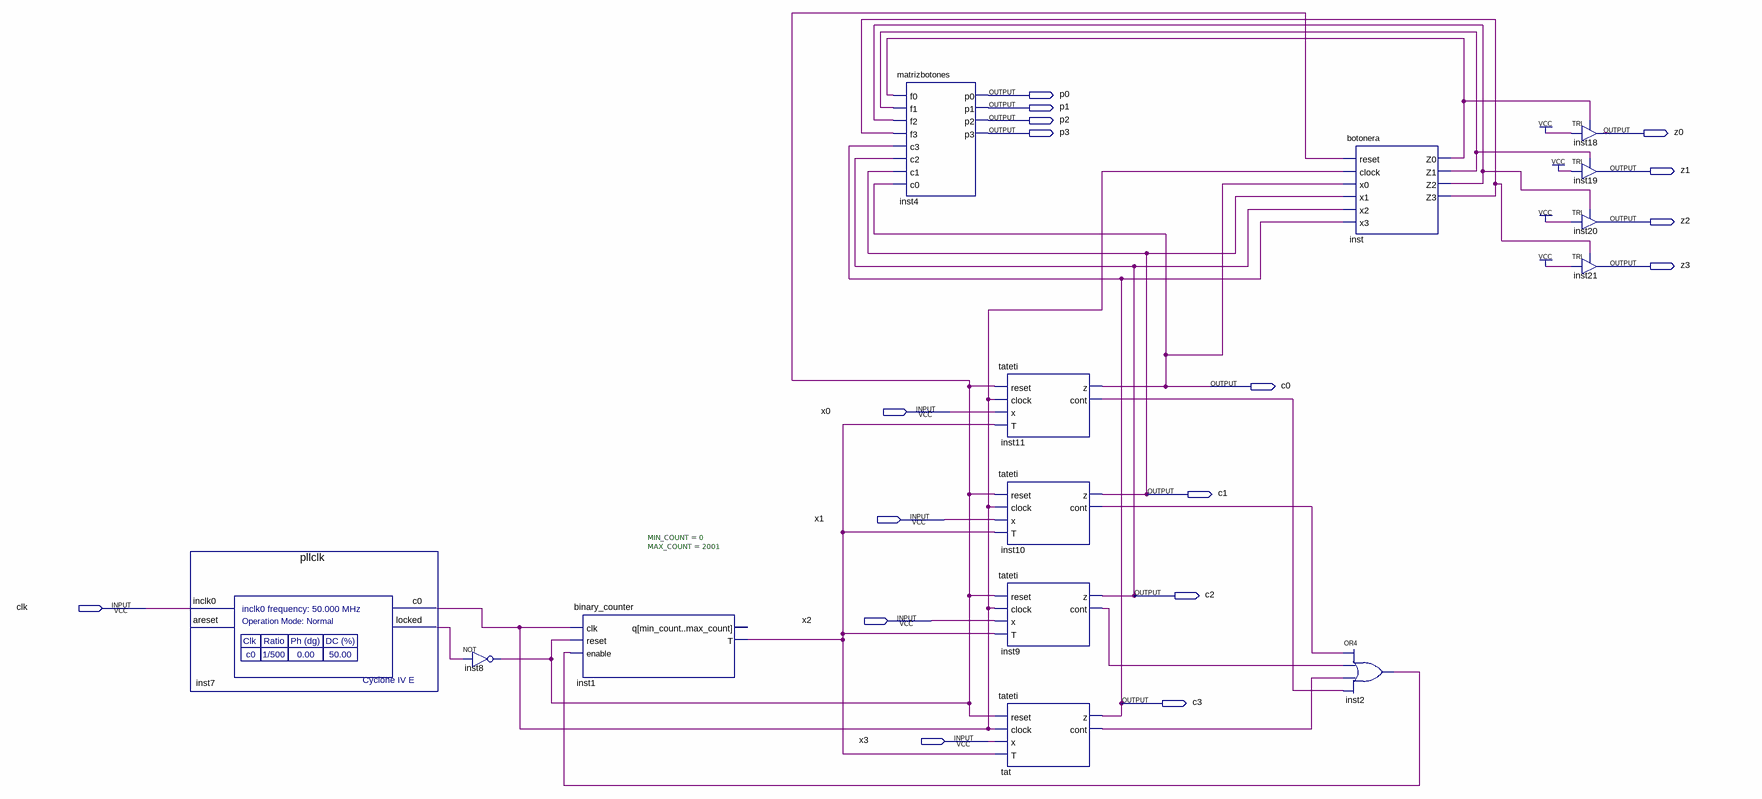
[diagram p0: schematic sheet]
// Quartus schematic Block1.bdf as structural Verilog: 14 symbols, 17 pins
module Block1 (
  input  x0,
  input  x1,
  input  clk,
  input  x2,
  input  x3,
  output p0,
  output p1,
  output p2,
  output p3,
  output z0,
  output z1,
  output z2,
  output z3,
  output c0,
  output c1,
  output c2,
  output c3
);

  wire inst1_t, inst2_out, inst7_c0, inst7_locked, inst8_out, inst9_cont, inst10_cont, inst11_cont, inst_z0,
       inst_z1, inst_z2, inst_z3, tat_cont;

  pllclk inst7 (.inclk0(clk), .c0(inst7_c0), .locked(inst7_locked));  // open: areset
  not inst8 (inst8_out, inst7_locked);
  binary_counter #(.MIN_COUNT(0), .MAX_COUNT(2001)) inst1 (
    .clk(inst7_c0), .reset(inst8_out), .enable(inst2_out), .T(inst1_t));  // open: q
  matrizbotones inst4 (
    .f0(inst_z0), .f1(inst_z1), .f2(inst_z2), .f3(inst_z3), .c3(c3), .c2(c2), .c1(c1), .c0(c0), .p0(p0),
    .p1(p1), .p2(p2), .p3(p3));
  tateti inst11 (.reset(inst8_out), .clock(inst7_c0), .x(x0), .T(inst1_t), .z(c0), .cont(inst11_cont));
  tateti inst10 (.reset(inst8_out), .clock(inst7_c0), .x(x1), .T(inst1_t), .z(c1), .cont(inst10_cont));
  tateti inst9 (.reset(inst8_out), .clock(inst7_c0), .x(x2), .T(inst1_t), .z(c2), .cont(inst9_cont));
  tateti tat (.reset(inst8_out), .clock(inst7_c0), .x(x3), .T(inst1_t), .z(c3), .cont(tat_cont));
  botonera inst (
    .reset(inst8_out), .clock(inst7_c0), .x0(c0), .x1(c1), .x2(c2), .x3(c3), .Z0(inst_z0), .Z1(inst_z1),
    .Z2(inst_z2), .Z3(inst_z3));
  or inst2 (inst2_out, inst10_cont, inst9_cont, tat_cont, inst11_cont);
  TRI inst18 (.IN(1'b1), .OE(inst_z0), .OUT(z0));
  TRI inst19 (.IN(1'b1), .OE(inst_z1), .OUT(z1));
  TRI inst20 (.IN(1'b1), .OE(inst_z2), .OUT(z2));
  TRI inst21 (.IN(1'b1), .OE(inst_z3), .OUT(z3));
endmodule
